# Altium schematic sheet wisp-6-afe.SchDoc: AFE
size B; SheetNumber: 3; SheetTotal: 4
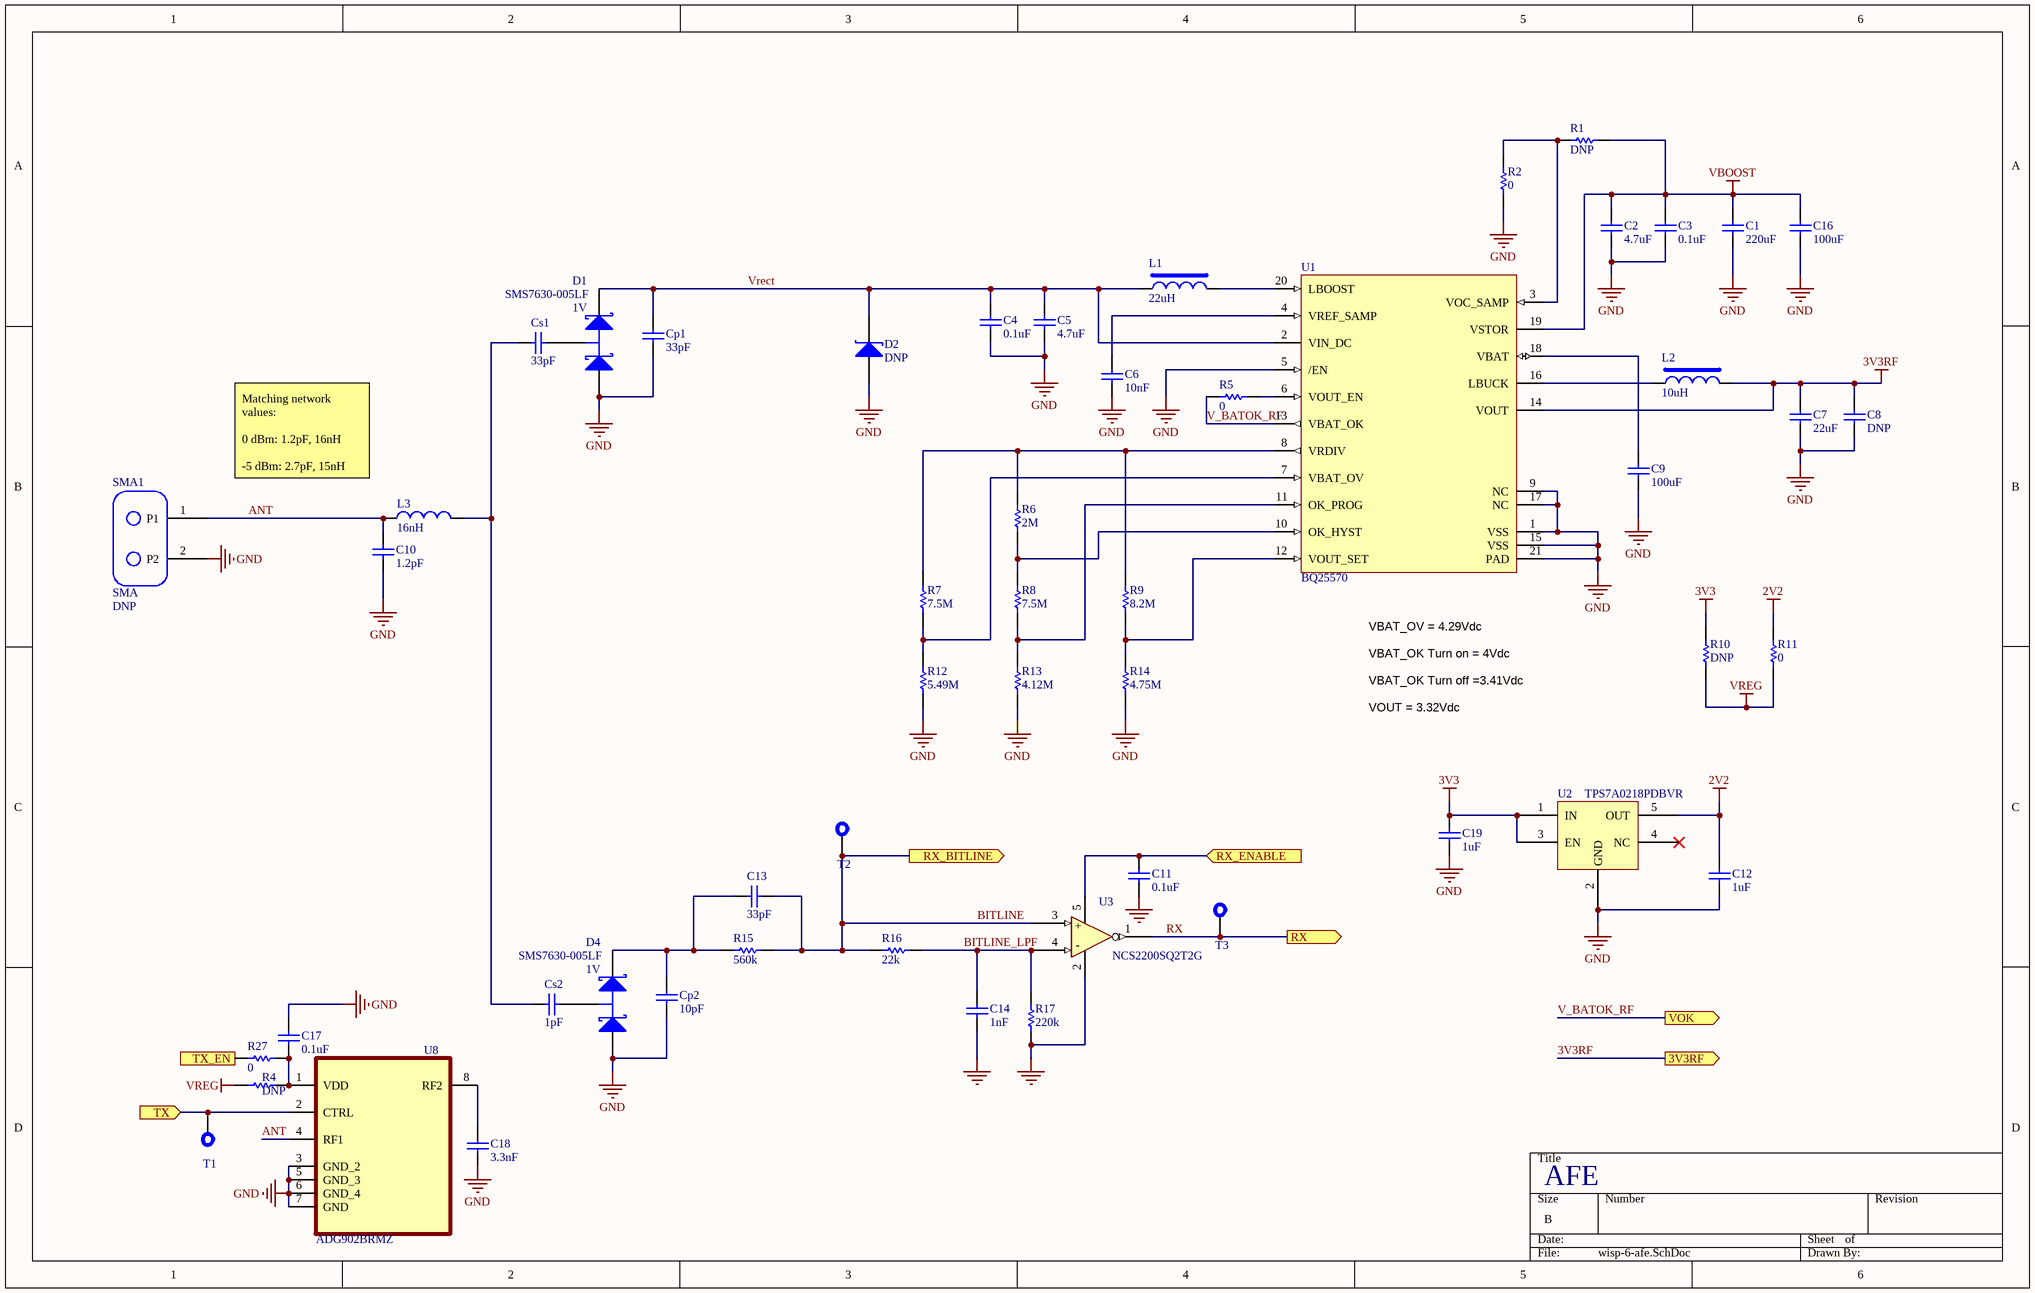
[diagram p0: wisp-6-afe.SchDoc]

## Parts
C1  value 220uF  [1206]  (hidden comment: Generic ceramic capacitor)
C2  value 4.7uF  [0402]  (hidden comment: Generic ceramic capacitor)
C3  value 0.1uF  [0402]  (hidden comment: Generic ceramic capacitor)
C4  value 0.1uF  [0402]  (hidden comment: Generic ceramic capacitor)
C5  value 4.7uF  [0402]  (hidden comment: Generic ceramic capacitor)
C6  value 10nF  [0402]  (hidden comment: Generic ceramic capacitor)
C7  value 22uF  [0402]  (hidden comment: Generic ceramic capacitor)
C8  value DNP  [0402]  (hidden comment: Generic capacitor)
C9  value 100uF  [0805]  (hidden comment: Generic ceramic capacitor)
C10  value 1.2pF  [0402]  (hidden comment: Generic capacitor)
C11  value 0.1uF  [0402]  (hidden comment: Generic ceramic capacitor)
C12  value 1uF  [0402]  (hidden comment: Generic ceramic capacitor)
C13  value 33pF  [0402]  (hidden comment: Generic capacitor)
C14  value 1nF  [0402]  (hidden comment: Generic ceramic capacitor)
C16  value 100uF  [0805]  (hidden comment: Generic ceramic capacitor)
C17  value 0.1uF  [0402]  (hidden comment: Generic ceramic capacitor)
C18  value 3.3nF  [0402]  (hidden comment: Generic capacitor)
C19  value 1uF  [0402]  (hidden comment: Generic ceramic capacitor)
Cp1  value 33pF  [0402]  (hidden comment: Generic capacitor)
Cp2  value 10pF  [0402]  (hidden comment: Generic capacitor)
Cs1  value 33pF  [0402]  (hidden comment: Generic capacitor)
Cs2  value 1pF  [0402]  (hidden comment: Generic capacitor)
D1  SMS7630-005LF  value 1V  [SOT23 - N]
D2  value DNP  [Zener_SOD-523]  (hidden comment: Generic diode - zener)
D4  SMS7630-005LF  value 1V  [SOT23 - N]
L1  value 22uH  [LPS4018]  (hidden comment: SMT shielded inductor)
L2  value 10uH  [IND1008]  (hidden comment: SMT shielded inductor)
L3  value 16nH  [0603]  (hidden comment: Generic inductor)
R1  value DNP  [0402]  (hidden comment: Generic resistor)
R2  value 0  [0402]  (hidden comment: Generic resistor)
R4  value DNP  [0402]  (hidden comment: Generic resistor)
R5  value 0  [0402]  (hidden comment: Generic resistor)
R6  value 2M  [0402]  (hidden comment: Generic resistor)
R7  value 7.5M  [0402]  (hidden comment: Generic resistor)
R8  value 7.5M  [0402]  (hidden comment: Generic resistor)
R9  value 8.2M  [0402]  (hidden comment: Generic resistor)
R10  value DNP  [0402]  (hidden comment: Generic resistor)
R11  value 0  [0402]  (hidden comment: Generic resistor)
R12  value 5.49M  [0402]  (hidden comment: Generic resistor)
R13  value 4.12M  [0402]  (hidden comment: Generic resistor)
R14  value 4.75M  [0402]  (hidden comment: Generic resistor)
R15  value 560k  [0402]  (hidden comment: Generic resistor)
R16  value 22k  [0402]  (hidden comment: Generic resistor)
R17  value 220k  [0402]  (hidden comment: Generic resistor)
R27  value 0  [0402]  (hidden comment: Generic resistor)
SMA1  SMA  value DNP  [SMA - Hole - 2 Pin]
T1  TP  [Test Point - Via]  (value not drawn)  (no BOM)
T2  TP  [Test Point - Via]  (value not drawn)  (no BOM)
T3  TP  [Test Point - Via]  (value not drawn)  (no BOM)
U1  BQ25570  [BQ25570]
U2  TPS7A0218PDBVR  [SOT23-5]
U3  NCS2200SQ2T2G  [SC70-5]
U8  ADG902BRMZ  [SOP65P490X110-8N]

## Ports
3V3RF (out), RX (out), RX_BITLINE (out), RX_ENABLE (in), TX (in), TX_EN (in), VOK (out)

## Nets
2V2: C12.2 R11.2 U2.5(OUT)
3V3: C19.2 R10.2 U2.1(IN) U2.3(EN)
3V3RF: C7.2 C8.2 L2.2 U1.14(VOUT) ; port 3V3RF
GND: C1.1 C2.1 C3.1 C4.1 C5.1 C6.1 C7.1 C8.1 C9.1 C10.1 C11.1 C12.1 C14.1 C16.1 C17.2 C18.1 C19.1 Cp1.2 Cp2.2 D1.1(A) D2.1(A) D4.1(A) R2.1 R12.1 R13.1 R14.1 R17.1 SMA1.2(P2) U1.1(VSS) U1.5(/EN) U1.9(NC) U1.15(VSS) U1.17(NC) U1.21(PAD) U2.2(GND) U3.2(Gnd) U8.3(GND_2) U8.5(GND_3) U8.6(GND_4) U8.7(GND)
VBOOST: C1.2 C2.2 C3.2 C16.2 R1.2 U1.19(VSTOR)
VREG: R4.2 R10.1 R11.1
ANT: C10.2 L3.1 SMA1.1(P1) U8.4(RF1)
BITLINE: C13.1 R15.2 R16.1 T2.0 U3.3(IN+) ; port RX_BITLINE
BITLINE_LPF: C14.2 R16.2 R17.2 U3.4(In-)
RX: T3.0 U3.1(OUT) ; port RX
RX_ENABLE: C11.2 U3.5(VDD) ; port RX_ENABLE
TX: T1.0 U8.2(CTRL) ; port TX
TX_EN: R27.2 ; port TX_EN
V_BATOK_RF: R5.1 U1.13(VBAT_OK) ; port VOK
Vrect: C4.2 C5.2 Cp1.1 D1.2(K) D2.2(K) L1.1 U1.2(VIN_DC)
NetC6_2: C6.2 U1.4(VREF_SAMP)
NetC9_2: C9.2 U1.18(VBAT)
NetC13_2: C13.2 Cp2.1 D4.2(K) R15.1
NetC17_1: C17.1 R4.1 R27.1 U8.1(VDD)
NetC18_2: C18.2 U8.8(RF2)
NetCs1_1: Cs1.1 D1.3(C)
NetCs1_2: Cs1.2 Cs2.2 L3.2
NetCs2_1: Cs2.1 D4.3(C)
NetL1_2: L1.2 U1.20(LBOOST)
NetL2_1: L2.1 U1.16(LBUCK)
NetR1_1: R1.1 R2.2 U1.3(VOC_SAMP)
NetR5_2: R5.2 U1.6(VOUT_EN)
NetR6_1: R6.1 R8.2 U1.10(OK_HYST)
NetR6_2: R6.2 R7.2 R9.2 U1.8(VRDIV)
NetR7_1: R7.1 R12.2 U1.7(VBAT_OV)
NetR8_1: R8.1 R13.2 U1.11(OK_PROG)
NetR9_1: R9.1 R14.2 U1.12(VOUT_SET)

Not connected (* = marked no-connect by the designer): U2 4(NC)*

## Notes on the sheet
- Matching network values:
  0 dBm: 1.2pF, 16nH
  -5 dBm: 2.7pF, 15nH
- VBAT_OV = 4.29Vdc
- VBAT_OK Turn on = 4Vdc
- VBAT_OK Turn off =3.41Vdc
- VOUT = 3.32Vdc
- (in symbol NCS2200) +; -

## Library data of the parts
C1 = C-220uF-6V3-X5R-1206: CAP CER 220UF 6.3V X5R 1206; Manufacturer: Murata Electronics; Manufacturer Part Number: GRM31CR60J227ME11L; Rating: 6.3V, -55~85C; Tolerance: +-20%; Digi-Key Part Number: 490-13970-1-ND; Note: *
C2 C5 = C-4.7uF-10V-X5R-0402: CAP CER 4.7UF 10V X5R 0402; Manufacturer: Samsung Electro-Mechanics; Manufacturer Part Number: CL05A475MP5NRNC; Rating: 10V, -55~85C; Tolerance: +-20%; Digi-Key Part Number: 1276-1482-1-ND; Note: *
C3 C4 C11 C17 = C-0.1uF-10V-X5R-0402: CAP CER 100nF/0.1UF 10V X5R 0402; Manufacturer: Samsung Electro-Mechanics; Manufacturer Part Number: CL05A104KP5NNNC; Rating: 10V, -55C~85C; Tolerance: +-10%; Digi-Key Part Number: 1276-1022-1-ND; Note: *
C6 = C-10nF-50V-X7R-0402: 10000 pF ±10% 50V Ceramic Capacitor X7R 0402 (1005 Metric); Manufacturer: Samsung Electro-Mechanics; Manufacturer Part Number: CL05B103KB5NNNC; Rating: 50V, -55~125C; Tolerance: +-10%; Digi-Key Part Number: 1276-1028-1-ND; Note: *
C7 = C-22uF-6V3-X5R-0402: CAP CER 22UF 6.3V X5R 0402; Manufacturer: Samsung Electro-Mechanics; Manufacturer Part Number: CL05A226MQ5N6J8; Rating: 6.3V, -55~85C; Tolerance: +-20%; Digi-Key Part Number: 1276-7090-1-ND; Note: *
C8 = cap: Ceramic Capacitor (Surface Mount); Digi-Key Part Number: *; Manufacturer: *; Manufacturer Part Number: *; Note: *; Rating: *; Tolerance: *
C9 C16 = C-100uF-6V3-X5R-0805: CAP CER 100UF 6.3V X5R 0805; Manufacturer: Murata Electronics; Manufacturer Part Number: GRM21BR60J107ME15L; Rating: 6.3V, -55~85C; Tolerance: +-20%; Digi-Key Part Number: 490-13981-1-ND; Note: *
C10 = cap: Ceramic Capacitor (Surface Mount); Manufacturer: Johanson Technology Inc.; Manufacturer Part Number: QSCF500Q1R2A1GV001T; Rating: 50V, -55~150C; Tolerance: +-0.05pF; Digi-Key Part Number: 712-QSCF500Q1R2A1GV001TCT-ND; Note: *
C12 C19 = C-1uF-10V-X5R-0402: CAP CER 1UF 10V X5R 0402; Manufacturer: Samsung Electro-Mechanics; Manufacturer Part Number: CL05A105KP5NNNC; Rating: 10V, -55~85C; Tolerance: +-10%; Digi-Key Part Number: 1276-1076-1-ND; Note: *
C13 Cp1 Cs1 = cap: Ceramic Capacitor (Surface Mount); Manufacturer: Johanson Technology Inc.; Manufacturer Part Number: QSCF500Q330F1GV001T; Rating: 50V, -55~150C; Tolerance: +-1%; Digi-Key Part Number: 712-QSCF500Q330F1GV001TCT-ND; Note: *
C14 = C-1nF-50V-C0G-0402: CAP CER 1000PF 50V C0G/NP0 0402; Manufacturer: Samsung Electro-Mechanics; Manufacturer Part Number: CL05C102JB5NNNC; Rating: 50V, -55~125C; Tolerance: +-5%; Digi-Key Part Number: 1276-1635-1-ND; Note: *
C18 = cap: Ceramic Capacitor (Surface Mount); Manufacturer: Murata Electronics; Manufacturer Part Number: GRM1555C1H332GE01D; Rating: 50V, -55~125C; Tolerance: +-2%; Digi-Key Part Number: 490-GRM1555C1H332GE01DCT-ND; Note: *
Cp2 = cap: Ceramic Capacitor (Surface Mount); Manufacturer: Johanson Technology Inc.; Manufacturer Part Number: QSCF500Q100F1GV001T; Rating: 50V, -55~150C; Tolerance: +-1%; Digi-Key Part Number: 712-QSCF500Q100F1GV001TCT-ND; Note: *
Cs2 = cap: Ceramic Capacitor (Surface Mount); Manufacturer: Johanson Technology Inc.; Manufacturer Part Number: QSCF500Q1R0B1GV001T; Rating: 50V, -55~150C; Tolerance: +-0.1pF; Digi-Key Part Number: 712-QSCF500Q1R0B1GV001TCT-ND; Note: *
D1 D4 = SMS7630-005LF: RF diode schottky / SOT-23 Series Pair / Ls=1.5nH; Manufacturer: Skyworks Solutions Inc.; Rating: 75mW, -65~150C; Manufacturer Part Number: SMS7630-005LF; Digi-Key Part Number: 863-1699-1-ND; Tolerance: *; Note: *
D2 = diode_zener: Diode - Zener; Manufacturer Part Number: *; Manufacturer: *; Digi-Key Part Number: *; Note: *; Tolerance: *; Rating: *
L1 = Ind-22uH-650mA-20%-LPS4018: 22 µH Shielded Drum Core Inductor 650 mA 360mOhm Max Nonstandard; Manufacturer: Coilcraft; Manufacturer Part Number: LPS4018-223MRC; Rating: 650mA; Tolerance: +-20%; Digi-Key Part Number: 2457-LPS4018-223MRC-ND; Note: *
L2 = Ind-10uH-800mA-20%-1008: FIXED IND 10UH 800MA 625 MOHM; Manufacturer: Würth Elektronik; Manufacturer Part Number: 74479889310; Tolerance: +-20%; Digi-Key Part Number: 732-74479889310CT-ND; Rating: 800mA; Note: *
L3 = ind: Inductor (Surface Mount); Manufacturer: Murata Electronics; Manufacturer Part Number: LQW18AS16NG00D; Rating: 700mA, -40~125C; Note: Equivalent to coilcraft 0603CS-16NXGL; Tolerance: +-2%; Digi-Key Part Number: 490-LQW18AS16NG00DCT-ND
R1 R4 R10 = res: Chip Resistor (Surface Mount); Manufacturer: *; Manufacturer Part Number: *; Digi-Key Part Number: *; Rating: *; Note: *; Tolerance: *
R2 R5 R11 R27 = R-0-0.063W-*-0402: RES 0 OHM JUMPER 1/16W 0402; Manufacturer: YAGEO; Manufacturer Part Number: RC0402JR-070RL; Digi-Key Part Number: 311-0.0JRCT-ND; Rating: 1/16W; Note: *; Tolerance: *
R6 = R-2M-0.063W-1%-0402: RES 2M OHM 1% 1/16W 0402; Manufacturer: YAGEO; Manufacturer Part Number: RC0402FR-072ML; Tolerance: +-1%; Digi-Key Part Number: 13-RC0402FR-072MLCT-ND; Rating: 1/16W; Note: *
R7 R8 = R-7M5-0.063W-5%-0402: RES 7.5M OHM 5% 1/16W 0402; Manufacturer: YAGEO; Manufacturer Part Number: RC0402JR-077M5L; Tolerance: +-5%; Digi-Key Part Number: YAG3315CT-ND; Rating: 1/16W; Note: *
R9 = R-8M2-0.063W-1%-0402: 8.2 MOhms ±1% 0.063W, 1/16W Chip Resistor 0402 (1005 Metric) Moisture Resistant Thick Film; Manufacturer: YAGEO; Manufacturer Part Number: RC0402FR-078M2L; Tolerance: +-1%; Digi-Key Part Number: 13-RC0402FR-078M2LCT-ND; Rating: 1/16W; Note: *
R12 = R-5M49-0.063W-1%-0402: 5.49 MOhms ±1% 0.063W, 1/16W Chip Resistor 0402 (1005 Metric) Moisture Resistant Thick Film; Manufacturer: YAGEO; Manufacturer Part Number: RC0402FR-075M49L; Tolerance: +-1%; Digi-Key Part Number: 13-RC0402FR-075M49LCT-ND; Rating: 1/16W; Note: *
R13 = R-4M12-0.063W-1%-0402: RES 4.12M OHM 1% 1/16W 0402; Manufacturer: YAGEO; Manufacturer Part Number: RC0402FR-074M12L; Tolerance: +-1%; Digi-Key Part Number: 13-RC0402FR-074M12LCT-ND; Rating: 1/16W; Note: *
R14 = R-4M75-0.063W-1%-0402: RES 4.75M OHM 1% 1/16W 0402; Manufacturer: YAGEO; Manufacturer Part Number: RC0402FR-074M75L; Tolerance: +-1%; Digi-Key Part Number: 13-RC0402FR-074M75LCT-ND; Rating: 1/16W; Note: *
R15 = R-560k-0.063W-1%-0402: RES 560K OHM 1% 1/16W 0402; Manufacturer: YAGEO; Manufacturer Part Number: RC0402FR-07560KL; Tolerance: +-1%; Digi-Key Part Number: 311-560KLRCT-ND; Rating: 1/16W; Note: *
R16 = R-22k-0.063W-1%-0402: RES 22K OHM 1% 1/16W 0402; Manufacturer: YAGEO; Manufacturer Part Number: RC0402FR-0722KL; Tolerance: +-1%; Digi-Key Part Number: 311-22.0KLRCT-ND; Rating: 1/16W; Note: *
R17 = R-220k-0.063W-1%-0402: RES 220K OHM 1% 1/16W 0402; Manufacturer: YAGEO; Manufacturer Part Number: RC0402FR-07220KL; Tolerance: +-1%; Digi-Key Part Number: 311-220KLRCT-ND; Rating: 1/16W; Note: *
SMA1 = SMA - Hole - 2 Pin: Two pin SMA connector wisp; Note: *; Manufacturer: *; Digi-Key Part Number: *; Manufacturer Part Number: *; Rating: *
T1-T3 = Test Point Via: Test Point, via no BOM
U1 = BQ25570: Buck-boost charger Energy Harvesting PMIC 20-VQFN (3.5x3.5); Manufacturer: Texas Instruments; Manufacturer Part Number: BQ25570RGRT; Rating: -40~125C; Digi-Key Part Number: 296-37014-1-ND; Value: *; Note: *
U2 = TPS7A0218PDBVR: Linear Voltage Regulator IC Positive Fixed 1 Output 200mA SOT-23-5; Manufacturer: Texas Instruments; Rating: 6V in, -40~125C; Value: 1.8V; Manufacturer Part Number: TPS7A0218PDBVR; Note: *; Digi-Key Part Number: 296-TPS7A0218PDBVRCT-ND; Tolerance: *
U3 = NCS2200: Comparator Standard (General Purpose) Complementary, Rail-to-Rail SC-88A (SC-70-5/SOT-353); Manufacturer: onsemi; Rating: 6V max, -40~105C; Digi-Key Part Number: NCS2200SQ2T2GOSCT-ND; Manufacturer Part Number: NCS2200SQ2T2G; Value: *; Note: *
U8 = ADG902BRMZ: RF Switch IC General Purpose SPST 2.5GHz 50Ohm 8-MSOP; Manufacturer: Analog Devices; Rating: 1.65V~2.75Vcc, -40~85C; Digi-Key Part Number: ADG902BRMZ-ND; Manufacturer Part Number: ADG902BRMZ; Value: *; Note: *